# EasyEDA schematic SCH_RGS-Turret_2023-06-20.json
TITLE: Sheet_1; REV: 1.0; Date: 2023-06-20; Sheet: 1/1; Company: Your Company
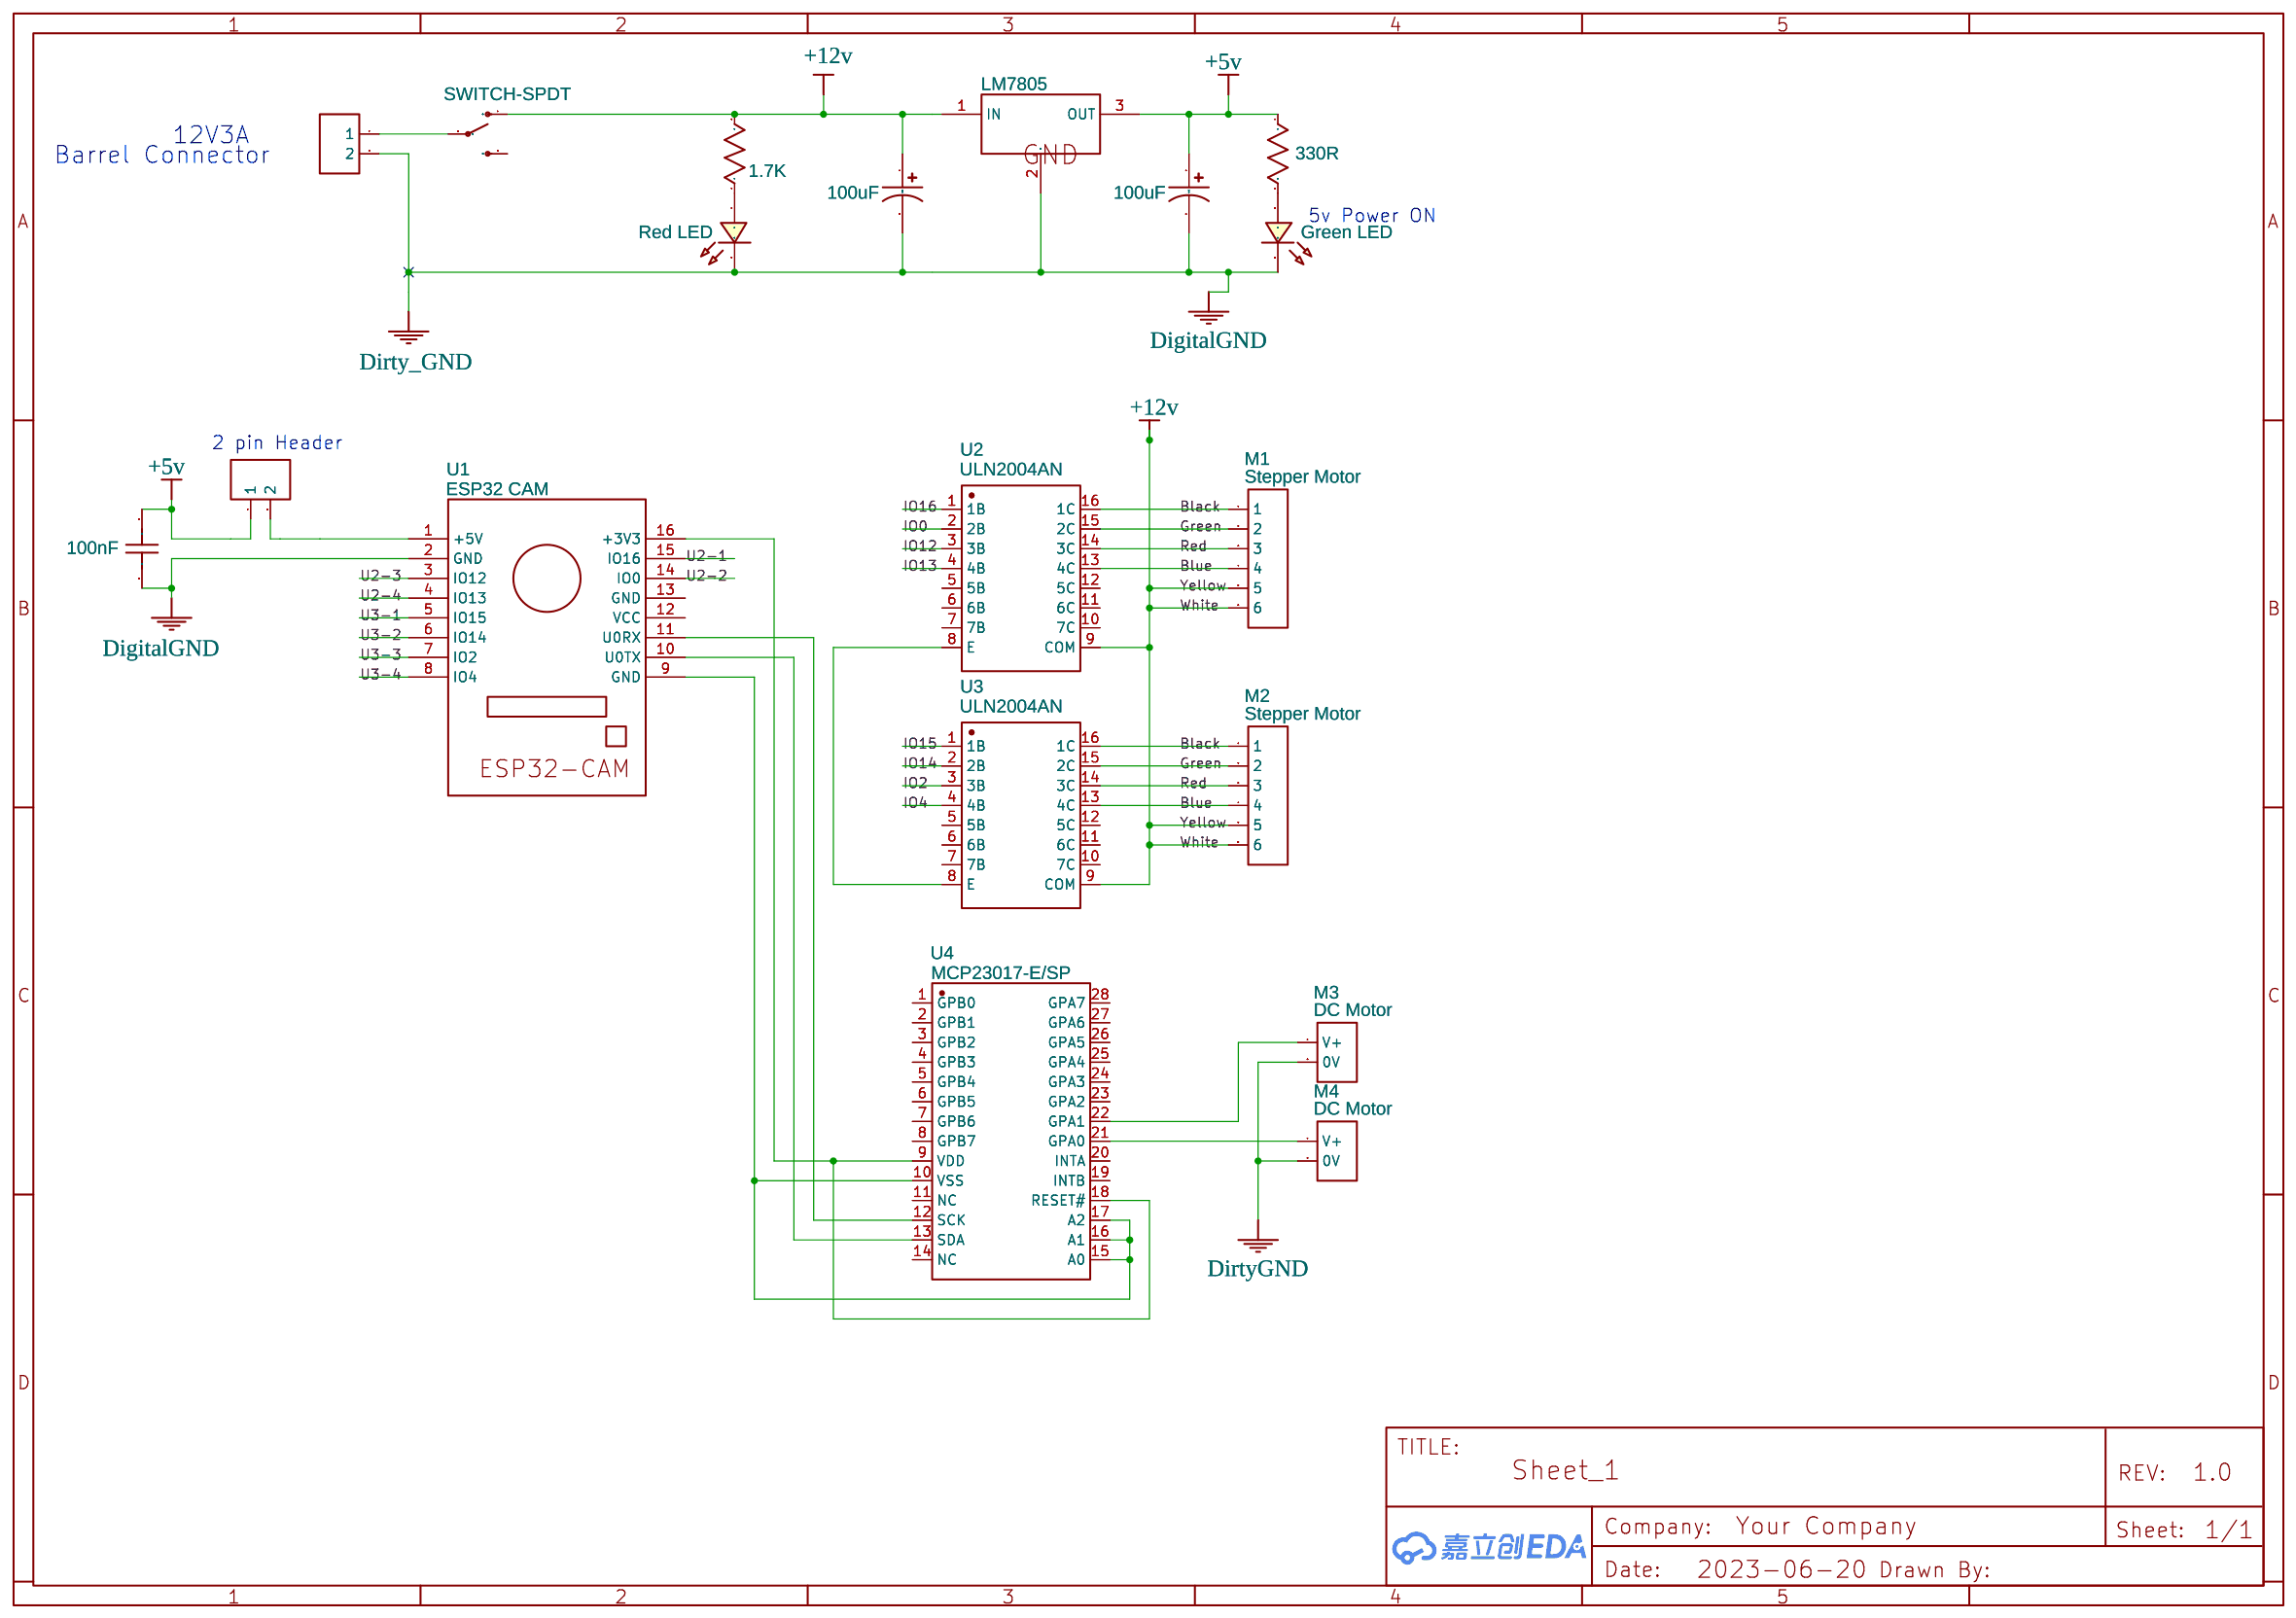
[diagram p0: schematic sheet]

## Parts
C1  100uF  [CASE-A_3216]
C2  100uF  [CASE-A_3216]
C3  100nF  [C0603]
H1  HDR-F-2.54_1x2  [HDR-F-2.54_1X2]
H2  HDR-F-2.54_1x2  [HDR-F-2.54_1X2]
LED1  Red LED  [LED0603_RED]
LED2  Green LED  [LED0603_RED]
M1  Stepper Motor  [HDR-F-2.54_1X6]
M2  Stepper Motor  [HDR-F-2.54_1X6]
M3  DC Motor  [HDR-F-2.54_1X2]
M4  DC Motor  [HDR-F-2.54_1X2]
R1  330R  [R0603]
R2  1.7K  [R0603]
S1  SWITCH-SPDT  [SWITCH-SPDT-SMD]
U1  ESP32 CAM  [ESP32-CAM]
U2  ULN2004AN  [DIP-16_L19.2-W6.6-P2.54-LS7.6-BL]
U3  ULN2004AN  [DIP-16_L19.2-W6.6-P2.54-LS7.6-BL]
U4  MCP23017-E/SP  [DIP-28_L34.6-W7.3-P2.54-LS10.2-BL]
U5  LM7805  [TO-220-3_L10.0-W4.5-P2.54-L]

## Library data of the parts
C1 C2 = C_Tan_SMD_A_US: Contributor: LCEDA_Lib
C3 = C_0603_US: Contributor: LCEDA_Lib
H1 H2 M3 M4 = HDR-F-2.54_1x2: Supplier Part: C49661; Supplier: LCSC; Contributor: LCEDA_Lib
LED1 LED2 = LED-0603_R: Manufacturer: EVERLIGHT(台湾亿光); Manufacturer Part: 19-217/R6C-AL1M2VY/3T; Supplier Part: C72044; Supplier: LCSC; Contributor: LCEDA_01
M1 M2 = HDR-F-2.54_1x6: Supplier Part: C40877; Supplier: LCSC; Contributor: LCEDA_Lib
R1 R2 = R_0603_US: Contributor: LCEDA_Lib
S1 = SWITCH-SPDT: Contributor: SparkFun
U1 = ESP32 CAM: Contributor: LGHT
U2 U3 = ULN2004AN: Supplier: LCSC; Manufacturer: TI; Supplier Part: C17226; JLCPCB Part Class: Extended Part
U4 = MCP23017-E/SP: Supplier: LCSC; Supplier Part: C647352; Manufacturer: MICROCHIP(美国微芯); Contributor: LCSC; JLCPCB Part Class: Extended Part
U5 = L7805CV-DG: Supplier: LCSC; Manufacturer: ST(意法半导体); Supplier Part: C3795; JLCPCB Part Class: Extended Part

## Nets
+5v: C1.1 C3.1 H2.1 R1.1 U5.3(OUT)
+12v: C2.1 M1.5 M1.6 M2.5 M2.6 R2.2 S1.1(O) U2.9(COM) U3.9(COM) U5.1(IN)
Black: M1.1 M2.1 U2.16(1C) U3.16(1C)
Blue: M1.4 M2.4 U2.13(4C) U3.13(4C)
DigitalGND: C1.2 C2.2 C3.2 H1.2 LED1.2 LED2.2 U1.2(GND) U5.2(GND)
DirtyGND: M3.2(0V) M4.2(0V)
Green: M1.2 M2.2 U2.15(2C) U3.15(2C)
IO0: U2.2(2B)
IO2: U3.3(3B)
IO4: U3.4(4B)
IO12: U2.3(3B)
IO13: U2.4(4B)
IO14: U3.2(2B)
IO15: U3.1(1B)
IO16: U2.1(1B)
Red: M1.3 M2.3 U2.14(3C) U3.14(3C)
U2-1: U1.15(IO16)
U2-2: U1.14(IO0)
U2-3: U1.3(IO12)
U2-4: U1.4(IO13)
U3-1: U1.5(IO15)
U3-2: U1.6(IO14)
U3-3: U1.7(IO2)
U3-4: U1.8(IO4)
Net-(H1-1): H1.1 S1.2(P)
Net-(H2-2): H2.2 U1.1(+5V)
Net-(LED1-1): LED1.1 R2.1
Net-(LED2-1): LED2.1 R1.2
Net-(M3-1): M3.1(V+) U4.22(GPA1)
Net-(M4-1): M4.1(V+) U4.21(GPA0)
Net-(U1-9): U1.9(GND) U4.10(VSS) U4.15(A0) U4.16(A1) U4.17(A2)
Net-(U1-10): U1.10(U0TX) U4.13(SDA)
Net-(U1-11): U1.11(U0RX) U4.12(SCK)
Net-(U1-16): U1.16(+3V3) U4.9(VDD) U4.18(RESET#)
Net-(U2-8): U2.8(E) U3.8(E)

Not connected (* = marked no-connect by the designer): S1 3(S); U1 12(VCC) 13(GND); U2 5(5B) 6(6B) 7(7B) 10(7C) 11(6C) 12(5C); U3 5(5B) 6(6B) 7(7B) 10(7C) 11(6C) 12(5C); U4 1(GPB0) 2(GPB1) 3(GPB2) 4(GPB3) 5(GPB4) 6(GPB5) 7(GPB6) 8(GPB7) 11(NC) 14(NC) 19(INTB) 20(INTA) 23(GPA2) 24(GPA3) 25(GPA4) 26(GPA5) 27(GPA6) 28(GPA7)

## Notes on the sheet
- 12V3A
- Barrel Connector
- 5v Power ON
- 2 pin Header
